# Altium schematic sheet LED_Driver.SchDoc: Sample Sheet Title
size B; Date: MM/DD/YYYY; Author: Sample Author; Organization: ORGANIZATION; Address1: ADDRESS 1; Address2: ADDRESS 2; Address3: ADDRESS 3; Address4: ADDRESS 4; Revision: -; SheetNumber: 1; SheetTotal: 1; ENG_APP_DATE: --/--/--; DSN_APP_DATE: --/--/--; CHK_APP_DATE: --/--/--
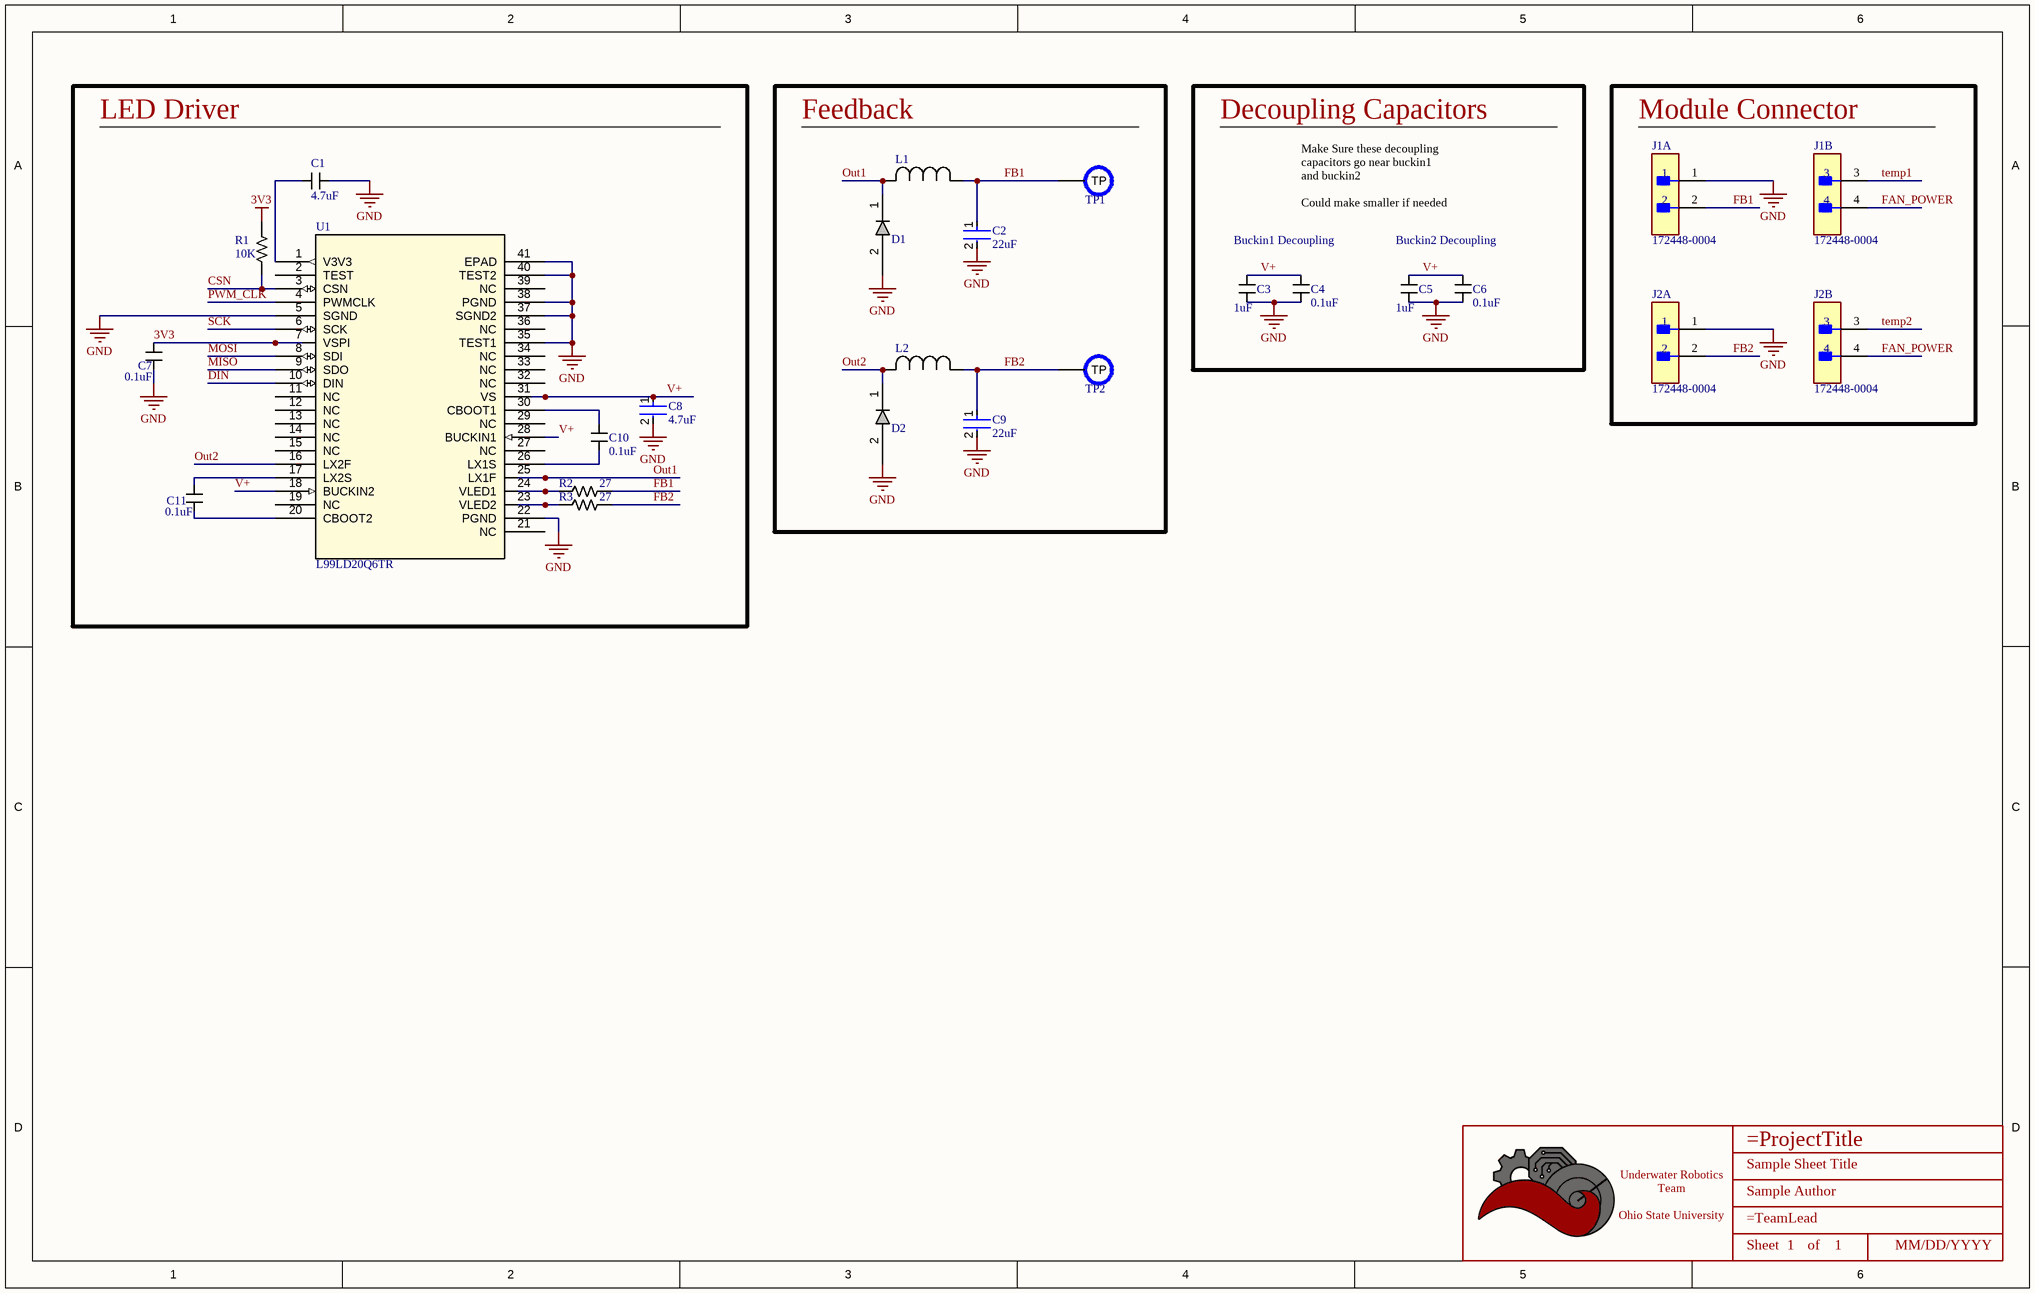
[diagram p0: LED_Driver.SchDoc]

## Parts
*  Title_Block  [LOGO]  (value not drawn)  (graphical)
C1  value 4.7uF  [CAPACITOR_0603]  (hidden comment: 4.7uF Ceramic 6.3V)
C2  22uF  [FP-C2012-125-0_2-MFG]
C3  value 1uF  [CAPACITOR_0603]  (hidden comment: 1uF Ceramic 25V)
C4  value 0.1uF  [CAPACITOR_0603]  (hidden comment: 100nF Ceramic 25V)
C5  value 1uF  [CAPACITOR_0603]  (hidden comment: 1uF Ceramic 25V)
C6  value 0.1uF  [CAPACITOR_0603]  (hidden comment: 100nF Ceramic 25V)
C7  value 0.1uF  [CAPACITOR_0603]  (hidden comment: 100nF Ceramic 6.3V)
C8  4.7uF  [CAPACITOR_0603]
C9  22uF  [FP-C2012-125-0_2-MFG]
C10  value 0.1uF  [CAPACITOR_0603]  (hidden comment: 100nF Ceramic 25V)
C11  value 0.1uF  [CAPACITOR_0603]  (hidden comment: 100nF Ceramic 25V)
D1  CCS15S40,L3F  [SOD-963   CST2C_TOS]  (value not drawn)
D2  CCS15S40,L3F  [SOD-963   CST2C_TOS]  (value not drawn)
J1  172448-0004  [FP-172448-0004-MFG]  (parts A,B of 2)
J2  172448-0004  [FP-172448-0004-MFG]  (parts A,B of 2)
L1  INDUCTOR_500uH  [IND_BOURNS_5256]  (value not drawn)
L2  INDUCTOR_500uH  [IND_BOURNS_5256]  (value not drawn)
R1  Value  (Ohms): 10K  [RESISTOR_0402]  (hidden comment: 10k Ohm 1% 1/16W)
R2  Value  (Ohms): 27  [RESISTOR_0603]  (hidden comment: 27 Ohm 5% 1/8W)
R3  Value  (Ohms): 27  [RESISTOR_0603]  (hidden comment: 27 Ohm 5% 1/8W)
TP1  PCB Test Point  [TESTPOINT_1.2MM]  (value not drawn)  (no BOM)
TP2  PCB Test Point  [TESTPOINT_1.2MM]  (value not drawn)  (no BOM)
U1  L99LD20Q6TR  [L99LD20Q6TR]

## Blocks framed on the sheet
LED Driver: C1 C7 C8 C10 C11 R1-R3 U1
Feedback: C2 C9 D1 D2 L1 L2 TP1 TP2
Decoupling Capacitors: C3-C6
Module Connector: J1 J2

## Nets
3V3: C7.1 R1.1 U1.7(VSPI)
GND: C1.1 C2.2 C3.1 C4.2 C5.1 C6.2 C7.2 C8.2 C9.2 D1.2 D2.2 J1.1 J2.1 U1.5(SGND) U1.22(PGND) U1.35(TEST1) U1.37(SGND2) U1.38(PGND) U1.40(TEST2) U1.41(EPAD)
CSN: R1.2 U1.3(CSN)
DIN: U1.10(DIN)
FAN_POWER: J1.4 J2.4
FB1: C2.1 J1.2 L1.1 R2.1 TP1.TP
FB2: C9.1 J2.2 L2.1 R3.1 TP2.TP
MISO: U1.9(SDO)
MOSI: U1.8(SDI)
Out1: D1.1 L1.2 U1.25(LX1F)
Out2: D2.1 L2.2 U1.16(LX2F)
PWM_CLK: U1.4(PWMCLK)
SCK: U1.6(SCK)
temp1: J1.3
temp2: J2.3
V+: C3.2 C4.1 C5.2 C6.1 C8.1 U1.18(BUCKIN2) U1.28(BUCKIN1) U1.31(VS)
NetC1_2: C1.2 U1.1(V3V3)
NetC10_1: C10.1 U1.30(CBOOT1)
NetC10_2: C10.2 U1.26(LX1S)
NetC11_1: C11.1 U1.17(LX2S)
NetC11_2: C11.2 U1.20(CBOOT2)
NetR2_2: R2.2 U1.24(VLED1)
NetR3_2: R3.2 U1.23(VLED2)

Not connected (* = marked no-connect by the designer): U1 2(TEST) 11(NC) 12(NC) 13(NC) 14(NC) 15(NC) 19(NC) 21(NC) 27(NC) 29(NC) 32(NC) 33(NC) 34(NC) 36(NC) 39(NC)

## Notes on the sheet
- Make Sure these decoupling capacitors go near buckin1 and buckin2
  Could make smaller if needed
- Buckin1 Decoupling
- Buckin2 Decoupling
- DWG. NO.
- REV.
- SHT.
- THIS DOCUMENT AND THE DATA DISCLOSED HEREIN OR HEREWITH IS THE PROPERTY OF ALTIUM LIMITED AND MAY BE FREELY DISTRIBUTED IN WHOLE. NO RIGHTS ARE RESERVED OR EXPRESS OR IMPLIED WARANTEE GIVEN.
- REVISION
- DESCRIPTION
- DATE
- APPROVED
- ENG:
- APPROVALS
- PROJECT
- DSN:
- CHK:
- REFERENCE DOCUMENTS
- PROJECT REVISION:
- TITLE
- DOCUMENT REVISION:
- DESIGN ITEM:
- BOM:
- FAB DWG:
- PCB DWG:
- ASSY DWG:
- SCALE:
- SIZE
- B
- CAGE CODE
- FILE NAME
- DWG NO.
- SHEET
- OF
- REV
- (in symbol Title_Block) Underwater Robotics Team / Ohio State University; Sheet; of

## Library data of the parts
* = Title_Block: UWRT Schematic Title Block Template / Created June 2021, Dylan Trainor
C1 = CAPACITOR_4.7uF_0603: Cap 4.7uF 6.3V +/-10% / Ceramic 0603; Made By: Robert Pafford; Tolerance: +/- 10%; Voltage: 6.3V; Supplier 1: Digi-Key; Supplier Part Number 1: 1276-2087-1-ND
C2 C9 = CMP-2000-06038-3: Multilayer Ceramic Capacitors 22μF ±20% 35V X5R SMD 0805; Tolerance: 20%; RoHS Compliant: Yes; Height: 1.25mm; Termination: SMD/SMT; Case/Package: 0805; Thickness: 0.057inch; Max Operating Temperature: 85°C; Min Operating Temperature: -55°C; Voltage Rating (DC): 35V; Length: 0.079inch; Dielectric: X5R; Dielectric Material: Ceramic; Capacitance: 22uF; Voltage Rating: 35V; Mount: Surface Mount; Package Quantity: 2000; Lead Free: Lead Free; Weight: 0.000194oz; REACH SVHC: No SVHC; Width: 0.049inch; Packaging: Tape and Reel; Series: C; Case Code (Metric): 2012; Case Code (Imperial): 0805
C3 C5 = CAPACITOR_1uF_0603_25V: Cap 1uF 25V +/-10% / Ceramic 0603; Voltage: 16V; Made By: Flip B; Tolerance: +/- 10%; Supplier 1: Digikey; Supplier Part Number 1: 1276-1102-1-ND
C4 C6 C10 C11 = CAPACITOR_0.1uF_0603_25V: Cap 100nF 25V +/-10% / Ceramic 0603; Voltage: 6.3V; Made By: Flip B; ComponentLink1Description: Datsheet; ComponentLink1URL: https://www.mouser.com/datasheet/2/212/KEM_C1002_X7R_SMD-1102033.pdf; Tolerance: +/- 10%; Supplier 1: Digikey; Supplier Part Number 1: 1276-1006-1-ND
C7 = CAPACITOR_0.1uF_0603_1: Cap 100nF 6.3V +/-10% / Ceramic 0603; Made By: Flip B; ComponentLink1Description: Datsheet; ComponentLink1URL: https://www.mouser.com/datasheet/2/212/KEM_C1002_X7R_SMD-1102033.pdf; Tolerance: +/- 10%; Voltage: 6.3V; Supplier 1: Digi-Key; Supplier Part Number 1: 399-15351-1-ND
C8 = CAP CERM 4.7UF 20% 35V: Chip Multilayer Ceramic Capacitors for General Purpose, 0603, 4.7uF, X5R, 15%, 20%, 35V; Voltage Rating (DC): 35V; Capacitance: 4.7uF; Dielectric: X5R; Case/Package: 0603; Min Operating Temperature: -55°C; Weight: 0.000222oz; Tolerance: 20%; Termination: SMD/SMT; Case Code (Imperial): 0603; Resistor Type: Ceramic; Thickness: 0.039inch; Case Code (Metric): 1608; Width: 0.8mm; Max Operating Temperature: 85°C; Mount: Surface Mount; Length: 0.063inch; Package Quantity: 4000; Height: 0.8mm; Voltage Rating: 35V; Packaging: Tape and Reel; Supplier 1: Arrow Electronics; Supplier Part Number 1: GRM188R6YA475ME15D
D1 D2 = SCHOTTKY_40V_1.5A: DIODE SCHOTTKY 40V 1.5A CST2C; Mfr_Name: Toshiba Electronic Devices & Storage Corp.; Type: DEV; Copyright: Copyright (C) 2023 Ultra Librarian. All rights reserved.; Manufacturer_Part_Number: CCS15S40,L3F; RefDes: RefDes; Supplier 1: Digi-Key; Supplier Part Number 1: CCS15S40L3FCT-ND
J1 J2 = CMP-00257-52824861-1: 172448-0004 Conn Power HDR 4 POS 4.2mm Solder RA Thru-Hole 4 Terminal 1 Port Mini-Fit Jr™ Frame; Manufacturer Lifecycle Status: ACTIVE; Current Rating: 13A; Voltage Rating: 600V; Row Spacing: 4.191mm; Number of Positions: 4; Connector Type: Male Pin; Glow Wire Compliant: Compliant; Contact Material: Tin; Min Operating Temperature: -40°C; Number of Rows: 2; NexarPartId: 52824861; Height: 12.03mm; Max Operating Temperature: 105°C; Pitch: 4.191mm; Number of Contacts: 4; RoHS: Compliant; Lifecycle Status: Production; Fastening Type: Ramp; Orientation: Right Angle; Mount: Through Hole; Termination: Solder; Color: Black; Number of Circuits: 4; Country of Origin: US; Contact Plating: Tin
L1 L2 = INDUCTOR_500uH: 5256-RC | 500 µH Unshielded Drum Core, Wirewound Inductor 2 A 260mOhm Max Axial, Through Hole; Mfr_Name: Bourns Electronics
R1 = RESISTOR_10K_0402: RES 10k OHM 1% 1/16W 0402; Tolerance: +/- 1%; Made By: Robert Pafford; Wattage: 1/16W; Supplier: Digikey; Digikey Part Numer: CR0603-JW-104ELFTR-ND; Supplier 1: Digi-Key; Supplier Part Number 1: YAG3436CT-ND
R2 R3 = RESISTOR_27_0603: RES 27 OHM 5% 1/8W 0603; Tolerance: +/- 5%; Made By: Robert Pafford; ComponentLink1Description: Datasheet; ComponentLink1URL: https://www.bourns.com/docs/product-datasheets/CRxxxxx.pdf; Wattage: 1/8W; Supplier: Digikey; Digikey Part Numer: CR0603-JW-104ELFTR-ND; Supplier 1: Digi-Key; Supplier Part Number 1: 2019-RK73B1JTTD270JCT-ND
TP1 TP2 = TESTPOINT: Made By: Robert Pafford
U1 = L99LD20Q6TR: IC LED DRVR RGLTR PWM 1.5A 40QFN; Mfr_Name: STMicroelectronics; Copyright: Copyright (C) 2023 Ultra Librarian. All rights reserved.; Manufacturer_Part_Number: L99LD20Q6TR; RefDes: RefDes; Type: DEV; Supplier 1: Digi-Key; Supplier Part Number 1: 497-18126-1-ND